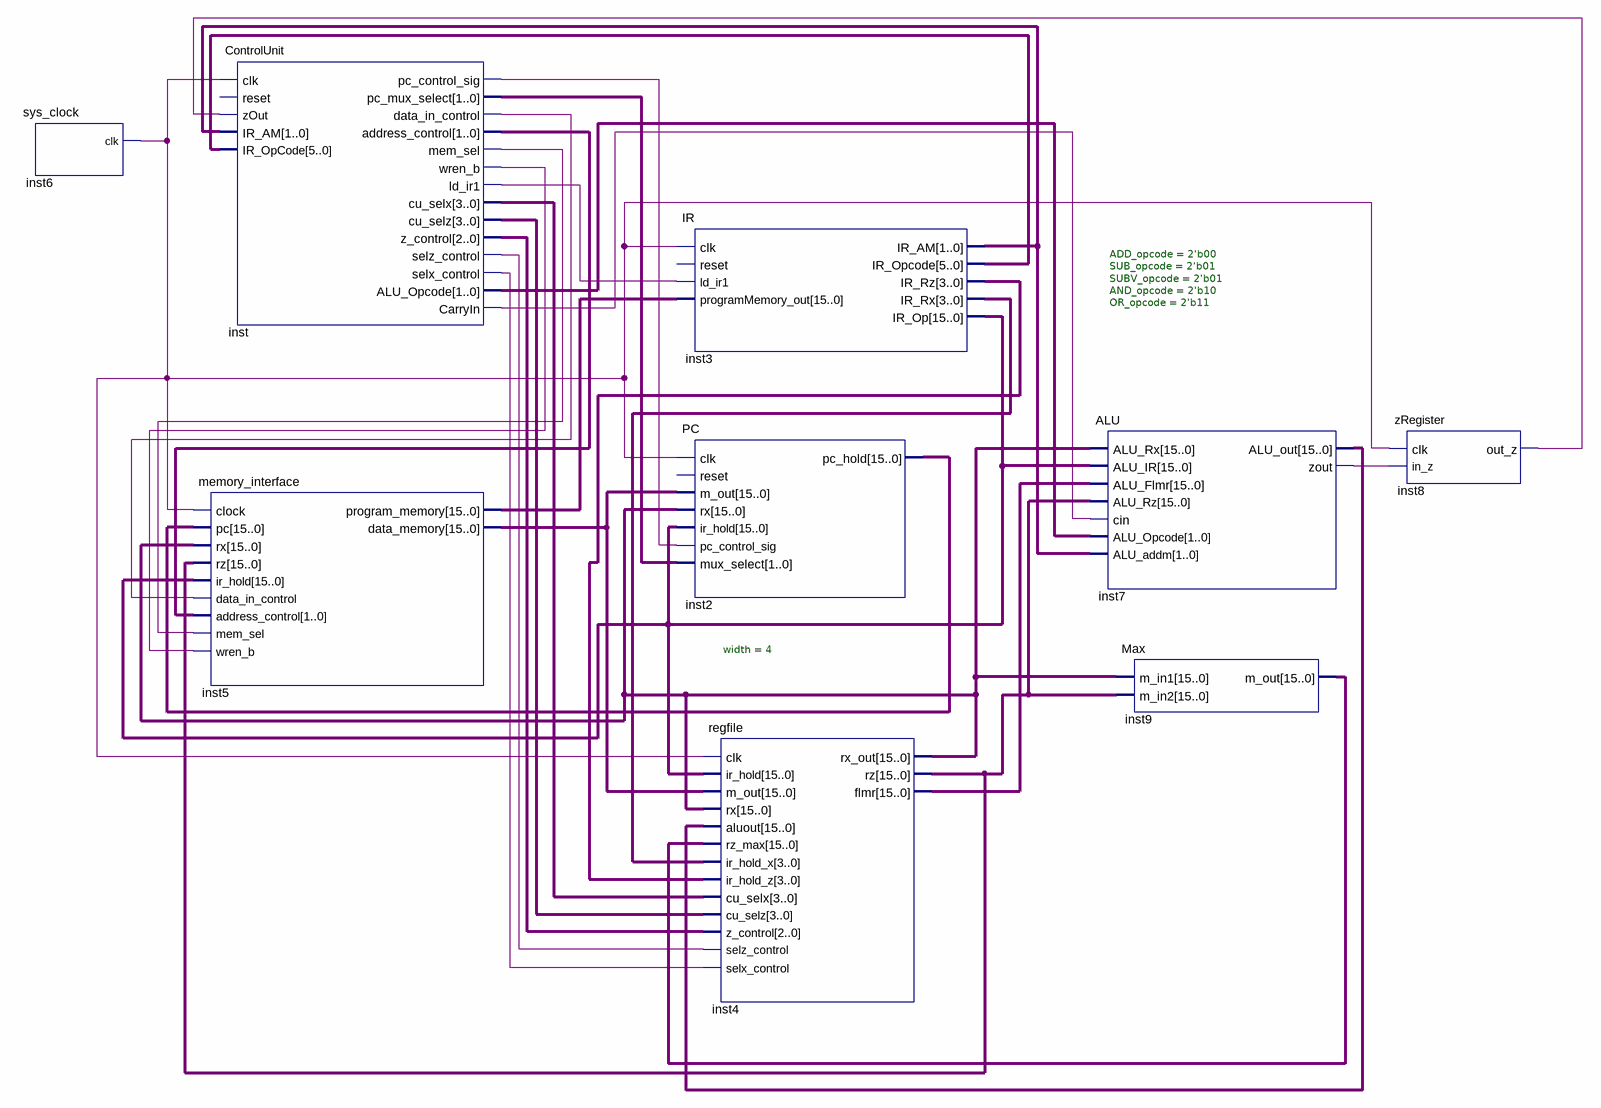
[diagram p0: schematic sheet]
// Quartus schematic top.bdf as structural Verilog: 9 symbols, 0 pins
module top (
);

  wire inst6_clk, inst7_zout, inst8_out_z, inst_carryin, inst_data_in_control, inst_ld_ir1, inst_mem_sel,
       inst_pc_control_sig, inst_selx_control, inst_selz_control, inst_wren_b;
  wire [1:0] inst3_ir_am, inst_address_control, inst_alu_opcode, inst_pc_mux_select;
  wire [2:0] inst_z_control;
  wire [3:0] inst3_ir_rx, inst3_ir_rz, inst_cu_selx, inst_cu_selz;
  wire [5:0] inst3_ir_opcode;
  wire [15:0] inst2_pc_hold, inst3_ir_op, inst4_flmr, inst4_rx_out, inst4_rz, inst5_data_memory,
       inst5_program_memory, inst7_alu_out, inst9_m_out;

  sys_clock inst6 (.clk(inst6_clk));
  ControlUnit inst (
    .clk(inst6_clk), .zOut(inst8_out_z), .IR_AM(inst3_ir_am), .IR_OpCode(inst3_ir_opcode),
    .pc_control_sig(inst_pc_control_sig), .pc_mux_select(inst_pc_mux_select),
    .data_in_control(inst_data_in_control), .address_control(inst_address_control), .mem_sel(inst_mem_sel),
    .wren_b(inst_wren_b), .ld_ir1(inst_ld_ir1), .cu_selx(inst_cu_selx), .cu_selz(inst_cu_selz),
    .z_control(inst_z_control), .selz_control(inst_selz_control), .selx_control(inst_selx_control),
    .ALU_Opcode(inst_alu_opcode), .CarryIn(inst_carryin));  // open: reset
  memory_interface inst5 (
    .clock(inst6_clk), .pc(inst2_pc_hold), .rx(inst4_rx_out), .rz(inst4_rz), .ir_hold(inst3_ir_op),
    .data_in_control(inst_data_in_control), .address_control(inst_address_control), .mem_sel(inst_mem_sel),
    .wren_b(inst_wren_b), .program_memory(inst5_program_memory), .data_memory(inst5_data_memory));
  IR inst3 (
    .clk(inst6_clk), .ld_ir1(inst_ld_ir1), .programMemory_out(inst5_program_memory), .IR_AM(inst3_ir_am),
    .IR_Opcode(inst3_ir_opcode), .IR_Rz(inst3_ir_rz), .IR_Rx(inst3_ir_rx), .IR_Op(inst3_ir_op));  // open: reset
  PC inst2 (
    .clk(inst6_clk), .m_out(inst5_data_memory), .rx(inst4_rx_out), .ir_hold(inst3_ir_op),
    .pc_control_sig(inst_pc_control_sig), .mux_select(inst_pc_mux_select), .pc_hold(inst2_pc_hold));  // open: reset
  regfile #(.width(4)) inst4 (
    .clk(inst6_clk), .ir_hold(inst3_ir_op), .m_out(inst5_data_memory), .rx(inst4_rx_out),
    .aluout(inst7_alu_out), .rz_max(inst9_m_out), .ir_hold_x(inst3_ir_rx), .ir_hold_z(inst3_ir_rz),
    .cu_selx(inst_cu_selx), .cu_selz(inst_cu_selz), .z_control(inst_z_control),
    .selz_control(inst_selz_control), .selx_control(inst_selx_control), .rx_out(inst4_rx_out), .rz(inst4_rz),
    .flmr(inst4_flmr));
  ALU #(.ADD_opcode(2'b00), .SUB_opcode(2'b01), .SUBV_opcode(2'b01), .AND_opcode(2'b10), .OR_opcode(2'b11)) inst7 (
    .ALU_Rx(inst4_rx_out), .ALU_IR(inst3_ir_op), .ALU_Flmr(inst4_flmr), .ALU_Rz(inst4_rz),
    .cin(inst_carryin), .ALU_Opcode(inst_alu_opcode), .ALU_addm(inst3_ir_am), .ALU_out(inst7_alu_out),
    .zout(inst7_zout));
  Max inst9 (.m_in1(inst4_rx_out), .m_in2(inst4_rz), .m_out(inst9_m_out));
  zRegister inst8 (.clk(inst6_clk), .in_z(inst7_zout), .out_z(inst8_out_z));
endmodule
